# Altium project Shuttler_AMC.PrjPcb (part 3 of 20)

## Sheet SDRAM_DDR3_4x16.SchDoc: =ProjectName
size 420 x 297 mm; Author: T.P.; CompanyName: WUT; DrawnBy: T.P.; Organization: WUT ISE; Address1: Warsaw Univeristy of Technology; Address2: Nowowiejska 15/19; DocumentNumber: 23; Revision: 0.9; SheetNumber: 23; SheetTotal: 36; EDA_Number: ARTIQ; Projet: ARTIQ/SINARA; ModifiedBy: -; CreateDate: XX/XX/XXXX; CheckedDate: -; Title2: SDRAM_DDR3_4x16.SchDoc; DivGrp: ISE; Designer: G.K. and T.P.; ModifiedDate: -; ProjectName: ADC/DAC MEZZANINE
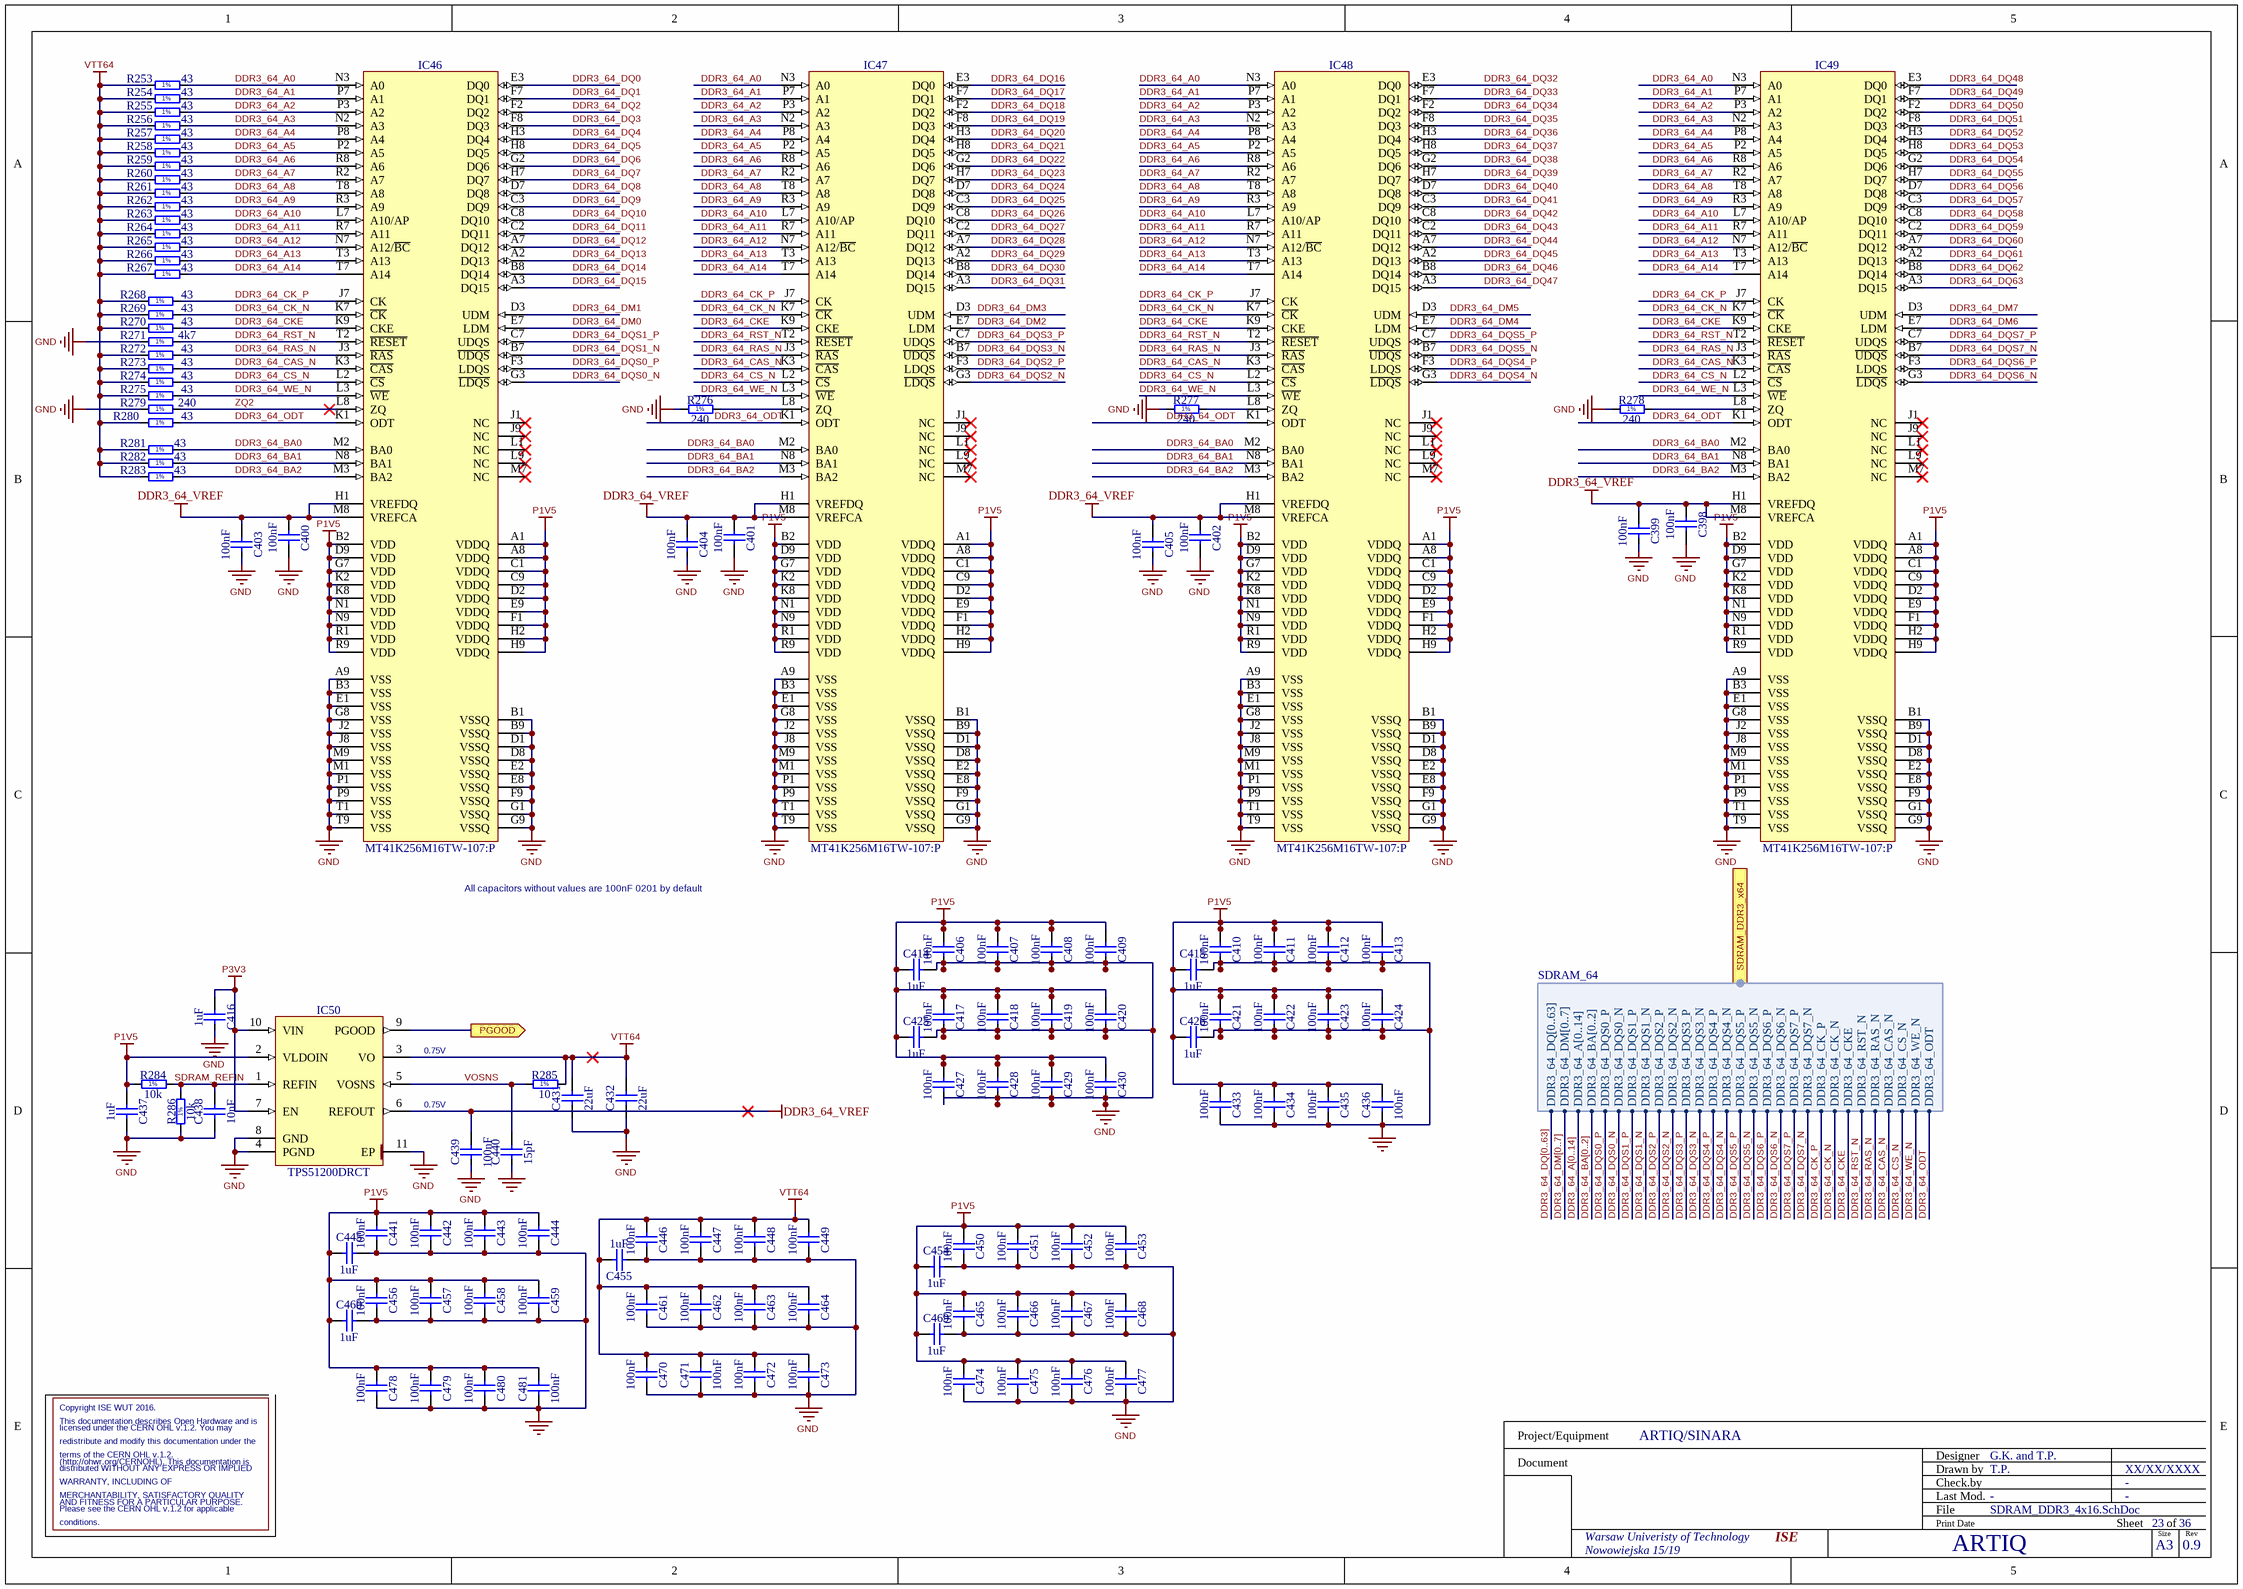
[diagram p3: SDRAM_DDR3_4x16.SchDoc]

### Parts
C398  100nF  [CAPC0603X33N]
C399  100nF  [CAPC0603X33N]
C400  100nF  [CAPC0603X33N]
C401  100nF  [CAPC0603X33N]
C402  100nF  [CAPC0603X33N]
C403  100nF  [CAPC0603X33N]
C404  100nF  [CAPC0603X33N]
C405  100nF  [CAPC0603X33N]
C406  100nF  [CAPC0603X33N]
C407  100nF  [CAPC0603X33N]
C408  100nF  [CAPC0603X33N]
C409  100nF  [CAPC0603X33N]
C410  100nF  [CAPC0603X33N]
C411  100nF  [CAPC0603X33N]
C412  100nF  [CAPC0603X33N]
C413  100nF  [CAPC0603X33N]
C414  1uF  [CAPC1005X55N]
C415  1uF  [CAPC1005X55N]
C416  1uF  [CAPC1005X55N]
C417  100nF  [CAPC0603X33N]
C418  100nF  [CAPC0603X33N]
C419  100nF  [CAPC0603X33N]
C420  100nF  [CAPC0603X33N]
C421  100nF  [CAPC0603X33N]
C422  100nF  [CAPC0603X33N]
C423  100nF  [CAPC0603X33N]
C424  100nF  [CAPC0603X33N]
C425  1uF  [CAPC1005X55N]
C426  1uF  [CAPC1005X55N]
C427  100nF  [CAPC0603X33N]
C428  100nF  [CAPC0603X33N]
C429  100nF  [CAPC0603X33N]
C430  100nF  [CAPC0603X33N]
C431  22uF  [CAPC2012X135N]
C432  22uF  [CAPC2012X135N]
C433  100nF  [CAPC0603X33N]
C434  100nF  [CAPC0603X33N]
C435  100nF  [CAPC0603X33N]
C436  100nF  [CAPC0603X33N]
C437  1uF  [CAPC1005X55N]
C438  10nF  [CAPC1005X55N]
C439  100nF  [CAPC0603X33N]
C440  15pF  [CAPC1005X55N]
C441  100nF  [CAPC0603X33N]
C442  100nF  [CAPC0603X33N]
C443  100nF  [CAPC0603X33N]
C444  100nF  [CAPC0603X33N]
C445  1uF  [CAPC1005X55N]
C446  100nF  [CAPC0603X33N]
C447  100nF  [CAPC0603X33N]
C448  100nF  [CAPC0603X33N]
C449  100nF  [CAPC0603X33N]
C450  100nF  [CAPC0603X33N]
C451  100nF  [CAPC0603X33N]
C452  100nF  [CAPC0603X33N]
C453  100nF  [CAPC0603X33N]
C454  1uF  [CAPC1005X55N]
C455  1uF  [CAPC1005X55N]
C456  100nF  [CAPC0603X33N]
C457  100nF  [CAPC0603X33N]
C458  100nF  [CAPC0603X33N]
C459  100nF  [CAPC0603X33N]
C460  1uF  [CAPC1005X55N]
C461  100nF  [CAPC0603X33N]
C462  100nF  [CAPC0603X33N]
C463  100nF  [CAPC0603X33N]
C464  100nF  [CAPC0603X33N]
C465  100nF  [CAPC0603X33N]
C466  100nF  [CAPC0603X33N]
C467  100nF  [CAPC0603X33N]
C468  100nF  [CAPC0603X33N]
C469  1uF  [CAPC1005X55N]
C470  100nF  [CAPC0603X33N]
C471  100nF  [CAPC0603X33N]
C472  100nF  [CAPC0603X33N]
C473  100nF  [CAPC0603X33N]
C474  100nF  [CAPC0603X33N]
C475  100nF  [CAPC0603X33N]
C476  100nF  [CAPC0603X33N]
C477  100nF  [CAPC0603X33N]
C478  100nF  [CAPC0603X33N]
C479  100nF  [CAPC0603X33N]
C480  100nF  [CAPC0603X33N]
C481  100nF  [CAPC0603X33N]
IC46  MT41K256M16TW-107:P  [BGA96C80P9X16_800X1400X120]
IC47  MT41K256M16TW-107:P  [BGA96C80P9X16_800X1400X120]
IC48  MT41K256M16TW-107:P  [BGA96C80P9X16_800X1400X120]
IC49  MT41K256M16TW-107:P  [BGA96C80P9X16_800X1400X120]
IC50  TPS51200DRCT  [TEXAS_DRC (S-PVSON-N10)]
R253  43  [RESC1005X40N]
R254  43  [RESC1005X40N]
R255  43  [RESC1005X40N]
R256  43  [RESC1005X40N]
R257  43  [RESC1005X40N]
R258  43  [RESC1005X40N]
R259  43  [RESC1005X40N]
R260  43  [RESC1005X40N]
R261  43  [RESC1005X40N]
R262  43  [RESC1005X40N]
R263  43  [RESC1005X40N]
R264  43  [RESC1005X40N]
R265  43  [RESC1005X40N]
R266  43  [RESC1005X40N]
R267  43  [RESC1005X40N]
R268  43  [RESC1005X40N]
R269  43  [RESC1005X40N]
R270  43  [RESC1005X40N]
R271  4k7  [RESC1005X40N]
R272  43  [RESC1005X40N]
R273  43  [RESC1005X40N]
R274  43  [RESC1005X40N]
R275  43  [RESC1005X40N]
R276  240  [RESC1005X40N]
R277  240  [RESC1005X40N]
R278  240  [RESC1005X40N]
R279  240  [RESC1005X40N]
R280  43  [RESC1005X40N]
R281  43  [RESC1005X40N]
R282  43  [RESC1005X40N]
R283  43  [RESC1005X40N]
R284  10k  [RESC1005X40N]
R285  10  [RESC1005X40N]
R286  10k  [RESC1005X40N]

### Ports
PGOOD (out), SDRAM_DDR3_x64 (harness SDRAM_64)

### Harnesses
SDRAM_64: DDR3_64_DQ[0..63], DDR3_64_DM[0..7], DDR3_64_A[0..14], DDR3_64_BA[0..2], DDR3_64_DQS1_P, DDR3_64_DQS0_N, DDR3_64_DQS0_P, DDR3_64_DQS5_P, DDR3_64_DQS5_N, DDR3_64_DQS6_P, DDR3_64_DQS6_N, DDR3_64_DQS7_P, DDR3_64_DQS7_N, DDR3_64_CK_P, DDR3_64_CK_N, DDR3_64_CKE, DDR3_64_RST_N, DDR3_64_RAS_N, DDR3_64_CAS_N, DDR3_64_WE_N, DDR3_64_CS_N, DDR3_64_DQS2_N, DDR3_64_DQS2_P, DDR3_64_DQS1_N, DDR3_64_DQS3_P, DDR3_64_ODT, DDR3_64_DQS4_P, DDR3_64_DQS3_N, DDR3_64_DQS4_N

### Nets
DDR3_64_VREF: C398.1 C399.1 C400.1 C401.1 C402.1 C403.1 C404.1 C405.1 C439.2 IC46.H1(VREFDQ) IC46.M8(VREFCA) IC47.H1(VREFDQ) IC47.M8(VREFCA) IC48.H1(VREFDQ) IC48.M8(VREFCA) IC49.H1(VREFDQ) IC49.M8(VREFCA) IC50.6(REFOUT)
GND: C398.2 C399.2 C400.2 C401.2 C402.2 C403.2 C404.2 C405.2 C406.2 C407.2 C408.2 C409.2 C410.2 C411.2 C412.2 C413.2 C414.2 C415.2 C416.2 C417.2 C418.2 C419.2 C420.2 C421.2 C422.2 C423.2 C424.2 C425.2 C426.2 C427.2 C428.2 C429.2 C430.2 C431.1 C432.1 C433.2 C434.2 C435.2 C436.1 C437.2 C438.1 C439.1 C440.1 C441.2 C442.2 C443.2 C444.2 C445.2 C446.2 C447.2 C448.2 C449.2 C450.2 C451.2 C452.2 C453.2 C454.2 C455.2 C456.2 C457.2 C458.2 C459.2 C460.2 C461.2 C462.2 C463.2 C464.2 C465.2 C466.2 C467.2 C468.2 C469.2 C470.2 C471.2 C472.2 C473.2 C474.2 C475.2 C476.2 C477.2 C478.2 C479.2 C480.2 C481.1 IC46.A9(VSS) IC46.B1(VSSQ) IC46.B3(VSS) IC46.B9(VSSQ) IC46.D1(VSSQ) IC46.D8(VSSQ) IC46.E1(VSS) IC46.E2(VSSQ) IC46.E8(VSSQ) IC46.F9(VSSQ) IC46.G1(VSSQ) IC46.G8(VSS) IC46.G9(VSSQ) IC46.J2(VSS) IC46.J8(VSS) IC46.M1(VSS) IC46.M9(VSS) IC46.P1(VSS) IC46.P9(VSS) IC46.T1(VSS) IC46.T9(VSS) IC47.A9(VSS) IC47.B1(VSSQ) IC47.B3(VSS) IC47.B9(VSSQ) IC47.D1(VSSQ) IC47.D8(VSSQ) IC47.E1(VSS) IC47.E2(VSSQ) IC47.E8(VSSQ) IC47.F9(VSSQ) IC47.G1(VSSQ) IC47.G8(VSS) IC47.G9(VSSQ) IC47.J2(VSS) IC47.J8(VSS) IC47.M1(VSS) IC47.M9(VSS) IC47.P1(VSS) IC47.P9(VSS) IC47.T1(VSS) IC47.T9(VSS) IC48.A9(VSS) IC48.B1(VSSQ) IC48.B3(VSS) IC48.B9(VSSQ) IC48.D1(VSSQ) IC48.D8(VSSQ) IC48.E1(VSS) IC48.E2(VSSQ) IC48.E8(VSSQ) IC48.F9(VSSQ) IC48.G1(VSSQ) IC48.G8(VSS) IC48.G9(VSSQ) IC48.J2(VSS) IC48.J8(VSS) IC48.M1(VSS) IC48.M9(VSS) IC48.P1(VSS) IC48.P9(VSS) IC48.T1(VSS) IC48.T9(VSS) IC49.A9(VSS) IC49.B1(VSSQ) IC49.B3(VSS) IC49.B9(VSSQ) IC49.D1(VSSQ) IC49.D8(VSSQ) IC49.E1(VSS) IC49.E2(VSSQ) IC49.E8(VSSQ) IC49.F9(VSSQ) IC49.G1(VSSQ) IC49.G8(VSS) IC49.G9(VSSQ) IC49.J2(VSS) IC49.J8(VSS) IC49.M1(VSS) IC49.M9(VSS) IC49.P1(VSS) IC49.P9(VSS) IC49.T1(VSS) IC49.T9(VSS) IC50.4(PGND) IC50.8(GND) IC50.11(EP) R271.1 R276.1 R277.1 R278.1 R279.1 R286.1
P1V5: C406.1 C407.1 C408.1 C409.1 C410.1 C411.1 C412.1 C413.1 C414.1 C415.1 C417.1 C418.1 C419.1 C420.1 C421.1 C422.1 C423.1 C424.1 C425.1 C426.1 C427.1 C428.1 C429.1 C430.1 C433.1 C434.1 C435.1 C436.2 C437.1 C441.1 C442.1 C443.1 C444.1 C445.1 C450.1 C451.1 C452.1 C453.1 C454.1 C456.1 C457.1 C458.1 C459.1 C460.1 C465.1 C466.1 C467.1 C468.1 C469.1 C474.1 C475.1 C476.1 C477.1 C478.1 C479.1 C480.1 C481.2 IC46.A1(VDDQ) IC46.A8(VDDQ) IC46.B2(VDD) IC46.C1(VDDQ) IC46.C9(VDDQ) IC46.D2(VDDQ) IC46.D9(VDD) IC46.E9(VDDQ) IC46.F1(VDDQ) IC46.G7(VDD) IC46.H2(VDDQ) IC46.H9(VDDQ) IC46.K2(VDD) IC46.K8(VDD) IC46.N1(VDD) IC46.N9(VDD) IC46.R1(VDD) IC46.R9(VDD) IC47.A1(VDDQ) IC47.A8(VDDQ) IC47.B2(VDD) IC47.C1(VDDQ) IC47.C9(VDDQ) IC47.D2(VDDQ) IC47.D9(VDD) IC47.E9(VDDQ) IC47.F1(VDDQ) IC47.G7(VDD) IC47.H2(VDDQ) IC47.H9(VDDQ) IC47.K2(VDD) IC47.K8(VDD) IC47.N1(VDD) IC47.N9(VDD) IC47.R1(VDD) IC47.R9(VDD) IC48.A1(VDDQ) IC48.A8(VDDQ) IC48.B2(VDD) IC48.C1(VDDQ) IC48.C9(VDDQ) IC48.D2(VDDQ) IC48.D9(VDD) IC48.E9(VDDQ) IC48.F1(VDDQ) IC48.G7(VDD) IC48.H2(VDDQ) IC48.H9(VDDQ) IC48.K2(VDD) IC48.K8(VDD) IC48.N1(VDD) IC48.N9(VDD) IC48.R1(VDD) IC48.R9(VDD) IC49.A1(VDDQ) IC49.A8(VDDQ) IC49.B2(VDD) IC49.C1(VDDQ) IC49.C9(VDDQ) IC49.D2(VDDQ) IC49.D9(VDD) IC49.E9(VDDQ) IC49.F1(VDDQ) IC49.G7(VDD) IC49.H2(VDDQ) IC49.H9(VDDQ) IC49.K2(VDD) IC49.K8(VDD) IC49.N1(VDD) IC49.N9(VDD) IC49.R1(VDD) IC49.R9(VDD) IC50.2(VLDOIN) R284.1
P3V3: C416.1 IC50.7(EN) IC50.10(VIN)
VTT64: C431.2 C432.2 C446.1 C447.1 C448.1 C449.1 C455.1 C461.1 C462.1 C463.1 C464.1 C470.1 C471.1 C472.1 C473.1 IC50.3(VO) R253.1 R254.1 R255.1 R256.1 R257.1 R258.1 R259.1 R260.1 R261.1 R262.1 R263.1 R264.1 R265.1 R266.1 R267.1 R268.1 R269.1 R270.1 R272.1 R273.1 R274.1 R275.1 R280.1 R281.1 R282.1 R283.1 R285.2
DDR3_64_A0: IC46.N3(A0) IC47.N3(A0) IC48.N3(A0) IC49.N3(A0) R253.2
DDR3_64_A1: IC46.P7(A1) IC47.P7(A1) IC48.P7(A1) IC49.P7(A1) R254.2
DDR3_64_A2: IC46.P3(A2) IC47.P3(A2) IC48.P3(A2) IC49.P3(A2) R255.2
DDR3_64_A3: IC46.N2(A3) IC47.N2(A3) IC48.N2(A3) IC49.N2(A3) R256.2
DDR3_64_A4: IC46.P8(A4) IC47.P8(A4) IC48.P8(A4) IC49.P8(A4) R257.2
DDR3_64_A5: IC46.P2(A5) IC47.P2(A5) IC48.P2(A5) IC49.P2(A5) R258.2
DDR3_64_A6: IC46.R8(A6) IC47.R8(A6) IC48.R8(A6) IC49.R8(A6) R259.2
DDR3_64_A7: IC46.R2(A7) IC47.R2(A7) IC48.R2(A7) IC49.R2(A7) R260.2
DDR3_64_A8: IC46.T8(A8) IC47.T8(A8) IC48.T8(A8) IC49.T8(A8) R261.2
DDR3_64_A9: IC46.R3(A9) IC47.R3(A9) IC48.R3(A9) IC49.R3(A9) R262.2
DDR3_64_A10: IC46.L7(A10/AP) IC47.L7(A10/AP) IC48.L7(A10/AP) IC49.L7(A10/AP) R263.2
DDR3_64_A11: IC46.R7(A11) IC47.R7(A11) IC48.R7(A11) IC49.R7(A11) R264.2
DDR3_64_A12: IC46.N7(A12/~{BC}) IC47.N7(A12/~{BC}) IC48.N7(A12/~{BC}) IC49.N7(A12/~{BC}) R265.2
DDR3_64_A13: IC46.T3(A13) IC47.T3(A13) IC48.T3(A13) IC49.T3(A13) R266.2
DDR3_64_A14: IC46.T7(A14) IC47.T7(A14) IC48.T7(A14) IC49.T7(A14) R267.2
DDR3_64_BA0: IC46.M2(BA0) IC47.M2(BA0) IC48.M2(BA0) IC49.M2(BA0) R281.2
DDR3_64_BA1: IC46.N8(BA1) IC47.N8(BA1) IC48.N8(BA1) IC49.N8(BA1) R282.2
DDR3_64_BA2: IC46.M3(BA2) IC47.M3(BA2) IC48.M3(BA2) IC49.M3(BA2) R283.2
DDR3_64_CAS_N: IC46.K3(~{CAS}) IC47.K3(~{CAS}) IC48.K3(~{CAS}) IC49.K3(~{CAS}) R273.2 ; port SDRAM_DDR3_x64.DDR3_64_CAS_N  [project net SDRAM_DDR3_x64.DDR3_64_CAS_N]
DDR3_64_CK_N: IC46.K7(~{CK}) IC47.K7(~{CK}) IC48.K7(~{CK}) IC49.K7(~{CK}) R269.2 ; port SDRAM_DDR3_x64.DDR3_64_CK_N  [project net SDRAM_DDR3_x64.DDR3_64_CK_N]
DDR3_64_CK_P: IC46.J7(CK) IC47.J7(CK) IC48.J7(CK) IC49.J7(CK) R268.2 ; port SDRAM_DDR3_x64.DDR3_64_CK_P  [project net SDRAM_DDR3_x64.DDR3_64_CK_P]
DDR3_64_CKE: IC46.K9(CKE) IC47.K9(CKE) IC48.K9(CKE) IC49.K9(CKE) R270.2 ; port SDRAM_DDR3_x64.DDR3_64_CKE  [project net SDRAM_DDR3_x64.DDR3_64_CKE]
DDR3_64_CS_N: IC46.L2(~{CS}) IC47.L2(~{CS}) IC48.L2(~{CS}) IC49.L2(~{CS}) R274.2 ; port SDRAM_DDR3_x64.DDR3_64_CS_N  [project net SDRAM_DDR3_x64.DDR3_64_CS_N]
DDR3_64_DM0: IC46.E7(LDM)
DDR3_64_DM1: IC46.D3(UDM)
DDR3_64_DM2: IC47.E7(LDM)
DDR3_64_DM3: IC47.D3(UDM)
DDR3_64_DM4: IC48.E7(LDM)
DDR3_64_DM5: IC48.D3(UDM)
DDR3_64_DM6: IC49.E7(LDM)
DDR3_64_DM7: IC49.D3(UDM)
DDR3_64_DQ0: IC46.E3(DQ0)
DDR3_64_DQ1: IC46.F7(DQ1)
DDR3_64_DQ2: IC46.F2(DQ2)
DDR3_64_DQ3: IC46.F8(DQ3)
DDR3_64_DQ4: IC46.H3(DQ4)
DDR3_64_DQ5: IC46.H8(DQ5)
DDR3_64_DQ6: IC46.G2(DQ6)
DDR3_64_DQ7: IC46.H7(DQ7)
DDR3_64_DQ8: IC46.D7(DQ8)
DDR3_64_DQ9: IC46.C3(DQ9)
DDR3_64_DQ10: IC46.C8(DQ10)
DDR3_64_DQ11: IC46.C2(DQ11)
DDR3_64_DQ12: IC46.A7(DQ12)
DDR3_64_DQ13: IC46.A2(DQ13)
DDR3_64_DQ14: IC46.B8(DQ14)
DDR3_64_DQ15: IC46.A3(DQ15)
DDR3_64_DQ16: IC47.E3(DQ0)
DDR3_64_DQ17: IC47.F7(DQ1)
DDR3_64_DQ18: IC47.F2(DQ2)
DDR3_64_DQ19: IC47.F8(DQ3)
DDR3_64_DQ20: IC47.H3(DQ4)
DDR3_64_DQ21: IC47.H8(DQ5)
DDR3_64_DQ22: IC47.G2(DQ6)
DDR3_64_DQ23: IC47.H7(DQ7)
DDR3_64_DQ24: IC47.D7(DQ8)
DDR3_64_DQ25: IC47.C3(DQ9)
DDR3_64_DQ26: IC47.C8(DQ10)
DDR3_64_DQ27: IC47.C2(DQ11)
DDR3_64_DQ28: IC47.A7(DQ12)
DDR3_64_DQ29: IC47.A2(DQ13)
DDR3_64_DQ30: IC47.B8(DQ14)
DDR3_64_DQ31: IC47.A3(DQ15)
DDR3_64_DQ32: IC48.E3(DQ0)
DDR3_64_DQ33: IC48.F7(DQ1)
DDR3_64_DQ34: IC48.F2(DQ2)
DDR3_64_DQ35: IC48.F8(DQ3)
DDR3_64_DQ36: IC48.H3(DQ4)
DDR3_64_DQ37: IC48.H8(DQ5)
DDR3_64_DQ38: IC48.G2(DQ6)
DDR3_64_DQ39: IC48.H7(DQ7)
DDR3_64_DQ40: IC48.D7(DQ8)
DDR3_64_DQ41: IC48.C3(DQ9)
DDR3_64_DQ42: IC48.C8(DQ10)
DDR3_64_DQ43: IC48.C2(DQ11)
DDR3_64_DQ44: IC48.A7(DQ12)
DDR3_64_DQ45: IC48.A2(DQ13)
DDR3_64_DQ46: IC48.B8(DQ14)
DDR3_64_DQ47: IC48.A3(DQ15)
DDR3_64_DQ48: IC49.E3(DQ0)
DDR3_64_DQ49: IC49.F7(DQ1)
DDR3_64_DQ50: IC49.F2(DQ2)
DDR3_64_DQ51: IC49.F8(DQ3)
DDR3_64_DQ52: IC49.H3(DQ4)
DDR3_64_DQ53: IC49.H8(DQ5)
DDR3_64_DQ54: IC49.G2(DQ6)
DDR3_64_DQ55: IC49.H7(DQ7)
DDR3_64_DQ56: IC49.D7(DQ8)
DDR3_64_DQ57: IC49.C3(DQ9)
DDR3_64_DQ58: IC49.C8(DQ10)
DDR3_64_DQ59: IC49.C2(DQ11)
DDR3_64_DQ60: IC49.A7(DQ12)
DDR3_64_DQ61: IC49.A2(DQ13)
DDR3_64_DQ62: IC49.B8(DQ14)
DDR3_64_DQ63: IC49.A3(DQ15)
DDR3_64_DQS0_N: IC46.G3(~{LDQS}) ; port SDRAM_DDR3_x64.DDR3_64_DQS0_N  [project net SDRAM_DDR3_x64.DDR3_64_DQS0_N]
DDR3_64_DQS0_P: IC46.F3(LDQS) ; port SDRAM_DDR3_x64.DDR3_64_DQS0_P  [project net SDRAM_DDR3_x64.DDR3_64_DQS0_P]
DDR3_64_DQS1_N: IC46.B7(~{UDQS}) ; port SDRAM_DDR3_x64.DDR3_64_DQS1_N  [project net SDRAM_DDR3_x64.DDR3_64_DQS1_N]
DDR3_64_DQS1_P: IC46.C7(UDQS) ; port SDRAM_DDR3_x64.DDR3_64_DQS1_P  [project net SDRAM_DDR3_x64.DDR3_64_DQS1_P]
DDR3_64_DQS2_N: IC47.G3(~{LDQS}) ; port SDRAM_DDR3_x64.DDR3_64_DQS2_N  [project net SDRAM_DDR3_x64.DDR3_64_DQS2_N]
DDR3_64_DQS2_P: IC47.F3(LDQS) ; port SDRAM_DDR3_x64.DDR3_64_DQS2_P  [project net SDRAM_DDR3_x64.DDR3_64_DQS2_P]
DDR3_64_DQS3_N: IC47.B7(~{UDQS}) ; port SDRAM_DDR3_x64.DDR3_64_DQS3_N  [project net SDRAM_DDR3_x64.DDR3_64_DQS3_N]
DDR3_64_DQS3_P: IC47.C7(UDQS) ; port SDRAM_DDR3_x64.DDR3_64_DQS3_P  [project net SDRAM_DDR3_x64.DDR3_64_DQS3_P]
DDR3_64_DQS4_N: IC48.G3(~{LDQS}) ; port SDRAM_DDR3_x64.DDR3_64_DQS4_N  [project net SDRAM_DDR3_x64.DDR3_64_DQS4_N]
DDR3_64_DQS4_P: IC48.F3(LDQS) ; port SDRAM_DDR3_x64.DDR3_64_DQS4_P  [project net SDRAM_DDR3_x64.DDR3_64_DQS4_P]
DDR3_64_DQS5_N: IC48.B7(~{UDQS}) ; port SDRAM_DDR3_x64.DDR3_64_DQS5_N  [project net SDRAM_DDR3_x64.DDR3_64_DQS5_N]
DDR3_64_DQS5_P: IC48.C7(UDQS) ; port SDRAM_DDR3_x64.DDR3_64_DQS5_P  [project net SDRAM_DDR3_x64.DDR3_64_DQS5_P]
DDR3_64_DQS6_N: IC49.G3(~{LDQS}) ; port SDRAM_DDR3_x64.DDR3_64_DQS6_N  [project net SDRAM_DDR3_x64.DDR3_64_DQS6_N]
DDR3_64_DQS6_P: IC49.F3(LDQS) ; port SDRAM_DDR3_x64.DDR3_64_DQS6_P  [project net SDRAM_DDR3_x64.DDR3_64_DQS6_P]
DDR3_64_DQS7_N: IC49.B7(~{UDQS}) ; port SDRAM_DDR3_x64.DDR3_64_DQS7_N  [project net SDRAM_DDR3_x64.DDR3_64_DQS7_N]
DDR3_64_DQS7_P: IC49.C7(UDQS) ; port SDRAM_DDR3_x64.DDR3_64_DQS7_P  [project net SDRAM_DDR3_x64.DDR3_64_DQS7_P]
DDR3_64_ODT: IC46.K1(ODT) IC47.K1(ODT) IC48.K1(ODT) IC49.K1(ODT) R280.2 ; port SDRAM_DDR3_x64.DDR3_64_ODT  [project net SDRAM_DDR3_x64.DDR3_64_ODT]
DDR3_64_RAS_N: IC46.J3(~{RAS}) IC47.J3(~{RAS}) IC48.J3(~{RAS}) IC49.J3(~{RAS}) R272.2 ; port SDRAM_DDR3_x64.DDR3_64_RAS_N  [project net SDRAM_DDR3_x64.DDR3_64_RAS_N]
DDR3_64_RST_N: IC46.T2(~{RESET}) IC47.T2(~{RESET}) IC48.T2(~{RESET}) IC49.T2(~{RESET}) R271.2 ; port SDRAM_DDR3_x64.DDR3_64_RST_N  [project net SDRAM_DDR3_x64.DDR3_64_RST_N]
DDR3_64_WE_N: IC46.L3(~{WE}) IC47.L3(~{WE}) IC48.L3(~{WE}) IC49.L3(~{WE}) R275.2 ; port SDRAM_DDR3_x64.DDR3_64_WE_N  [project net SDRAM_DDR3_x64.DDR3_64_WE_N]
SDRAM_PGOOD: IC50.9(PGOOD) ; port PGOOD
SDRAM_REFIN: C438.2 IC50.1(REFIN) R284.2 R286.2
VOSNS: C440.2 IC50.5(VOSNS) R285.1
ZQ2: IC46.L8(ZQ) R279.2
NetIC47_L8: IC47.L8(ZQ) R276.2
NetIC48_L8: IC48.L8(ZQ) R277.2
NetIC49_L8: IC49.L8(ZQ) R278.2

Not connected (* = marked no-connect by the designer): IC46 J1(NC)* J9(NC)* L1(NC)* L9(NC)* M7(NC)*; IC47 J1(NC)* J9(NC)* L1(NC)* L9(NC)* M7(NC)*; IC48 J1(NC)* J9(NC)* L1(NC)* L9(NC)* M7(NC)*; IC49 J1(NC)* J9(NC)* L1(NC)* L9(NC)* M7(NC)*

### Buses and harness runs
bus DDR3_64_A[0..14]
bus DDR3_64_BA[0..2]
bus DDR3_64_DM[0..7]
bus DDR3_64_DQ[0..63]

### Notes on the sheet
- All capacitors without values are 100nF 0201 by default
- (near IC50) 0.75V
- 0.75V
- Copyright ISE WUT 2016.
- terms of the CERN OHL v.1.2.
- This documentation describes Open Hardware and is
- (http://ohwr.org/CERNOHL). This documentation is
- redistribute and modify this documentation under the
- distributed WITHOUT ANY EXPRESS OR IMPLIED
- WARRANTY, INCLUDING OF
- licensed under the CERN OHL v.1.2. You may
- Please see the CERN OHL v.1.2 for applicable
- conditions.
- MERCHANTABILITY, SATISFACTORY QUALITY
- AND FITNESS FOR A PARTICULAR PURPOSE.
- Project/Equipment
- Document
- Designer
- Drawn by
- Check.by
- File
- Last Mod.
- Print Date
- Sheet
- Size
- A3
- of
- Rev
- (in symbol R0402_4K7_1%_0.0625W_100PPM) 1%
- (in symbol R0402_10K_1%_0.0625W_100PPM) 1%
- (in symbol R0402_10R_1%_0.0625W_200PPM) 1%
- (in symbol R0402_43R_1%_0.0625W_100PPM) 1%
- (in symbol R0402_240R_1%_0.0625W_100PPM) 1%

### Library data of the parts
C398-C413 C417-C424 C427-C430 C433-C436 C439 C441-C444 C446-C453 C456-C459 C461-C468 C470-C481 = CC0201_100NF_6.3V_10%_X5R: Non-polarised capacitor; Manufacturer: GENERIC; Manufacturer1 Part Number: 02016D104KAT2A; Part Description: SMD Multilayer Chip Ceramic Capacitor; TC: X5R; Tolerance: ±10%; Voltage: 6.3V; Author: CERN DEM JLC; Case: 0201; Component Kind: Standard; Component Type: Standard; CreateDate: 03.12.2007; HelpURL: \\cern.ch\dfs\Applications\Altium\Datasheets\CC0201_X5R_AVX.pdf; LatestRevisionDate: 03.12.2007; Manufacturer Part Number: CC0201_100NF_6.3V_10%_X5R; Manufacturer1 ComponentHeight: 0.33mm; Manufacturer1 Example: AVX; Mounted: Yes; Part Number: CC0201_100NF_6.3V_10%_X5R; Pin Count: 2; SMD: Yes; Socket: No; Status: Not Recommended; Value: 100nF; Sense: No
C414-C416 C425 C426 C437 C445 C454 C455 C460 C469 = CC0402_1UF_16V_10%_X5R: Non-polarised capacitor; Manufacturer: GENERIC; Part Description: SMD Multilayer Chip Ceramic Capacitor; Manufacturer1 Part Number: C1005X5R1C105KT; Tolerance: ±10%; Voltage: 16V; TC: X5R; Manufacturer Part Number: CC0402_1UF_16V_10%_X5R; Part Number: CC0402_1UF_16V_10%_X5R; Value: 1uF; Component Kind: Standard; Component Type: Standard; Pin Count: 2; Status: Preferred; Case: 0402; Mounted: Yes; Socket: No; SMD: Yes; Sense: No; Manufacturer1 Example: TDK; Manufacturer1 ComponentHeight: 0.55mm; HelpURL: \\cern.ch\dfs\Applications\Altium\Datasheets\CC0402_X5R_TDK_C.pdf; Author: CERN DEM JLC; CreateDate: 25.10.2012; LatestRevisionDate: 25.10.2012
C431 C432 = CC0805_22UF_10V_+80%-20%_Y5V: Non-polarised capacitor; Manufacturer: GENERIC; Part Description: SMD Multilayer Chip Ceramic Capacitor; Manufacturer1 Part Number: 2222 241 19881; Voltage: 10V; TC: Y5V; Manufacturer Part Number: CC0805_22UF_10V_+80%-20%_Y5V; Part Number: CC0805_22UF_10V_+80%-20%_Y5V; Tolerance: +80% -20%; Value: 22uF; Component Kind: Standard; Component Type: Standard; Pin Count: 2; Status: Preferred; Case: 0805; Mounted: Yes; Socket: No; SMD: Yes; Sense: No; Manufacturer1 Example: PHYCOMP; Manufacturer1 ComponentHeight: 1.45mm; HelpURL: \\cern.ch\dfs\Applications\Altium\Datasheets\CC0805_Y5V_PHYCOMP.pdf; Author: CERN DEM JLC; CreateDate: 03.12.2007; LatestRevisionDate: 03.12.2007
C438 = CC0402_10NF_25V_10%_X7R: Non-polarised capacitor; Manufacturer: GENERIC; Part Description: SMD Multilayer Chip Ceramic Capacitor; Manufacturer1 Part Number: C1005X7R1E103KT; Tolerance: ±10%; Voltage: 25V; TC: X7R; Manufacturer Part Number: CC0402_10NF_25V_10%_X7R; Part Number: CC0402_10NF_25V_10%_X7R; Value: 10nF; Component Kind: Standard; Component Type: Standard; Pin Count: 2; Status: Preferred; Case: 0402; Mounted: Yes; Socket: No; SMD: Yes; Sense: No; Manufacturer1 Example: TDK; Manufacturer1 ComponentHeight: 0.55mm; HelpURL: \\cern.ch\dfs\Applications\Altium\Datasheets\CC0402_X7R_TDK_C.pdf; Author: CERN DEM JLC; CreateDate: 25.10.2012; LatestRevisionDate: 25.10.2012
C440 = CC0402_15PF_50V_5%_C0G: Non-polarised capacitor; Manufacturer: GENERIC; Part Description: SMD Multilayer Chip Ceramic Capacitor; Manufacturer1 Part Number: C0402C150J5GACTU; Tolerance: ±5%; Voltage: 50V; TC: C0G/NP0; Manufacturer Part Number: CC0402_15PF_50V_5%_C0G; Part Number: CC0402_15PF_50V_5%_C0G; Value: 15pF; Component Kind: Standard; Component Type: Standard; Pin Count: 2; Status: Preferred; Case: 0402; Mounted: Yes; Socket: No; SMD: Yes; Sense: No; Manufacturer1 Example: KEMET; Manufacturer1 ComponentHeight: 0.55mm; HelpURL: \\cern.ch\dfs\Applications\Altium\Datasheets\CC0805_C0G_KEMET_(Commercial Grade).pdf; Author: CERN DEM JLC; CreateDate: 03.12.2007; LatestRevisionDate: 22.04.2015
IC46-IC49 = MT41K256M16TW-107:P: 32 Meg x 16 x 8 Banks DDR3L SDRAM; Part Description: +1.5V, 4Gb (32Meg x 16 x 8 banks) DDR3L SDRAM; Manufacturer: MICRON TECHNOLOGY; PressFit: No; Bonding: No; Part Number: MT41K256M16TW-107:P; Component Kind: Standard; Component Type: Standard; Device: MT41K256M16TW-107:P; PackageDescription: BGA 0.8mm, Pitch, Square 96 Pin, 9 Columns x 16 Rows, Body 14mm X 8mm X 1.2mm H; Manufacturer Part Number: MT41K256M16TW-107:P; Pin Count: 96; Case: BGA96; Mounted: Yes; Socket: No; SMD: Yes; Sense: No; ComponentHeight: 1.2mm; HelpURL: \\cern.ch\dfs\Applications\Altium\Datasheets\MT41K256M16TW-107-P.pdf; Author: CERN DEM MR; CreateDate: 14.12.2015; LatestRevisionDate: 14.12.2015
IC50 = TPS51200DRCT: Sink/Source DDR Termination Regulator; Manufacturer: TEXAS INSTRUMENTS; Part Description: 3.3V Sink/Source DDR Termination Regulator; PressFit: No; Bonding: No; Manufacturer Part Number: TPS51200DRCT; PackageDescription: SON, 0.50mm Pitch, 10-pin, 3.00mm W  X 3.00mm L X 1.00mm Height, (w/thermal tab 1.75 X 2.50 mm); Part Number: TPS51200DRCT; Component Kind: Standard; Component Type: Standard; Device: TPS51200DRCT; Pin Count: 11; Case: SON10; Mounted: Yes; Socket: No; SMD: Yes; Sense: No; ComponentHeight: 1mm; HelpURL: \\cern.ch\dfs\Applications\Altium\Datasheets\TPS51200DRCT.pdf; Author: CERN DEM JLC; CreateDate: 03.02.2010; LatestRevisionDate: 06.11.2013
R253-R270 R272-R275 R280-R283 = R0402_43R_1%_0.0625W_100PPM: Resistor - 1%; Manufacturer: GENERIC; Part Description: General Purpose Thick Film Chip Resistor; Manufacturer1 Part Number: 232270674309L; TC: ±100ppm/°C; PressFit: No; Manufacturer Part Number: R0402_43R_1%_0.0625W_100PPM; Part Number: R0402_43R_1%_0.0625W_100PPM; Tolerance: ±1%; Value: 43; Component Kind: Standard; Component Type: Standard; Pin Count: 2; Status: Not Recommended; Power: 0.0625W; Case: 0402; Mounted: Yes; Sense: No; Socket: No; SMD: Yes; Manufacturer1 Example: YAGEO PHYCOMP; Manufacturer1 ComponentHeight: 0.4mm; HelpURL: \\cern.ch\dfs\Applications\Altium\Datasheets\R0402_Phycomp_RC0402.pdf; Author: CERN DEM JLC; CreateDate: 03.12.2007; LatestRevisionDate: 17.10.2012
R271 = R0402_4K7_1%_0.0625W_100PPM: Resistor - 1%; Manufacturer: GENERIC; Part Description: General Purpose Thick Film Chip Resistor; Manufacturer1 Part Number: 232270674702L; TC: ±100ppm/°C; PressFit: No; Manufacturer Part Number: R0402_4K7_1%_0.0625W_100PPM; Part Number: R0402_4K7_1%_0.0625W_100PPM; Tolerance: ±1%; Value: 4k7; Component Kind: Standard; Component Type: Standard; Pin Count: 2; Status: Not Recommended; Power: 0.0625W; Case: 0402; Mounted: Yes; Sense: No; Socket: No; SMD: Yes; Manufacturer1 Example: YAGEO PHYCOMP; Manufacturer1 ComponentHeight: 0.4mm; HelpURL: \\cern.ch\dfs\Applications\Altium\Datasheets\R0402_Phycomp_RC0402.pdf; Author: CERN DEM JLC; CreateDate: 03.12.2007; LatestRevisionDate: 17.10.2012
R276-R279 = R0402_240R_1%_0.0625W_100PPM: Resistor - 1%; Manufacturer: GENERIC; Part Description: General Purpose Thick Film Chip Resistor; Manufacturer1 Part Number: 232270672401L; TC: ±100ppm/°C; PressFit: No; Manufacturer Part Number: R0402_240R_1%_0.0625W_100PPM; Part Number: R0402_240R_1%_0.0625W_100PPM; Tolerance: ±1%; Value: 240; Component Kind: Standard; Component Type: Standard; Pin Count: 2; Status: Not Recommended; Power: 0.0625W; Case: 0402; Mounted: Yes; Sense: No; Socket: No; SMD: Yes; Manufacturer1 Example: YAGEO PHYCOMP; Manufacturer1 ComponentHeight: 0.4mm; HelpURL: \\cern.ch\dfs\Applications\Altium\Datasheets\R0402_Phycomp_RC0402.pdf; Author: CERN DEM JLC; CreateDate: 03.12.2007; LatestRevisionDate: 17.10.2012
R284 R286 = R0402_10K_1%_0.0625W_100PPM: Resistor - 1%; Manufacturer: GENERIC; Part Description: General Purpose Thick Film Chip Resistor; Manufacturer1 Part Number: 232270671003L; TC: ±100ppm/°C; PressFit: No; Manufacturer Part Number: R0402_10K_1%_0.0625W_100PPM; Part Number: R0402_10K_1%_0.0625W_100PPM; Tolerance: ±1%; Value: 10k; Component Kind: Standard; Component Type: Standard; Pin Count: 2; Status: Not Recommended; Power: 0.0625W; Case: 0402; Mounted: Yes; Sense: No; Socket: No; SMD: Yes; Manufacturer1 Example: YAGEO PHYCOMP; Manufacturer1 ComponentHeight: 0.4mm; HelpURL: \\cern.ch\dfs\Applications\Altium\Datasheets\R0402_Phycomp_RC0402.pdf; Author: CERN DEM JLC; CreateDate: 03.12.2007; LatestRevisionDate: 17.10.2012
R285 = R0402_10R_1%_0.0625W_200PPM: Resistor - 1%; Manufacturer: GENERIC; Part Description: General Purpose Thick Film Chip Resistor; Manufacturer1 Part Number: 232270671009L; TC: ±200ppm/°C; PressFit: No; Manufacturer Part Number: R0402_10R_1%_0.0625W_200PPM; Part Number: R0402_10R_1%_0.0625W_200PPM; Tolerance: ±1%; Value: 10; Component Kind: Standard; Component Type: Standard; Pin Count: 2; Status: Not Recommended; Power: 0.0625W; Case: 0402; Mounted: Yes; Sense: No; Socket: No; SMD: Yes; Manufacturer1 Example: YAGEO PHYCOMP; Manufacturer1 ComponentHeight: 0.4mm; HelpURL: \\cern.ch\dfs\Applications\Altium\Datasheets\R0402_Phycomp_RC0402.pdf; Author: CERN DEM JLC; CreateDate: 24.06.2009; LatestRevisionDate: 17.10.2012

## Sheet JTAG_Configuration.SchDoc: =ProjectName
size 420 x 297 mm; Author: T.P.; CompanyName: WUT; DrawnBy: T.P.; Organization: WUT ISE; Address1: Warsaw Univeristy of Technology; Address2: Nowowiejska 15/19; DocumentNumber: 33; Revision: 0.9; SheetNumber: 33; SheetTotal: 36; EDA_Number: ARTIQ; Projet: ARTIQ/SINARA; ModifiedBy: -; CreateDate: XX/XX/XXXX; CheckedDate: -; Title2: JTAG_Configuration.SchDoc; DivGrp: ISE; Designer: G.K. and T.P.; ModifiedDate: -; ProjectName: ADC/DAC MEZZANINE
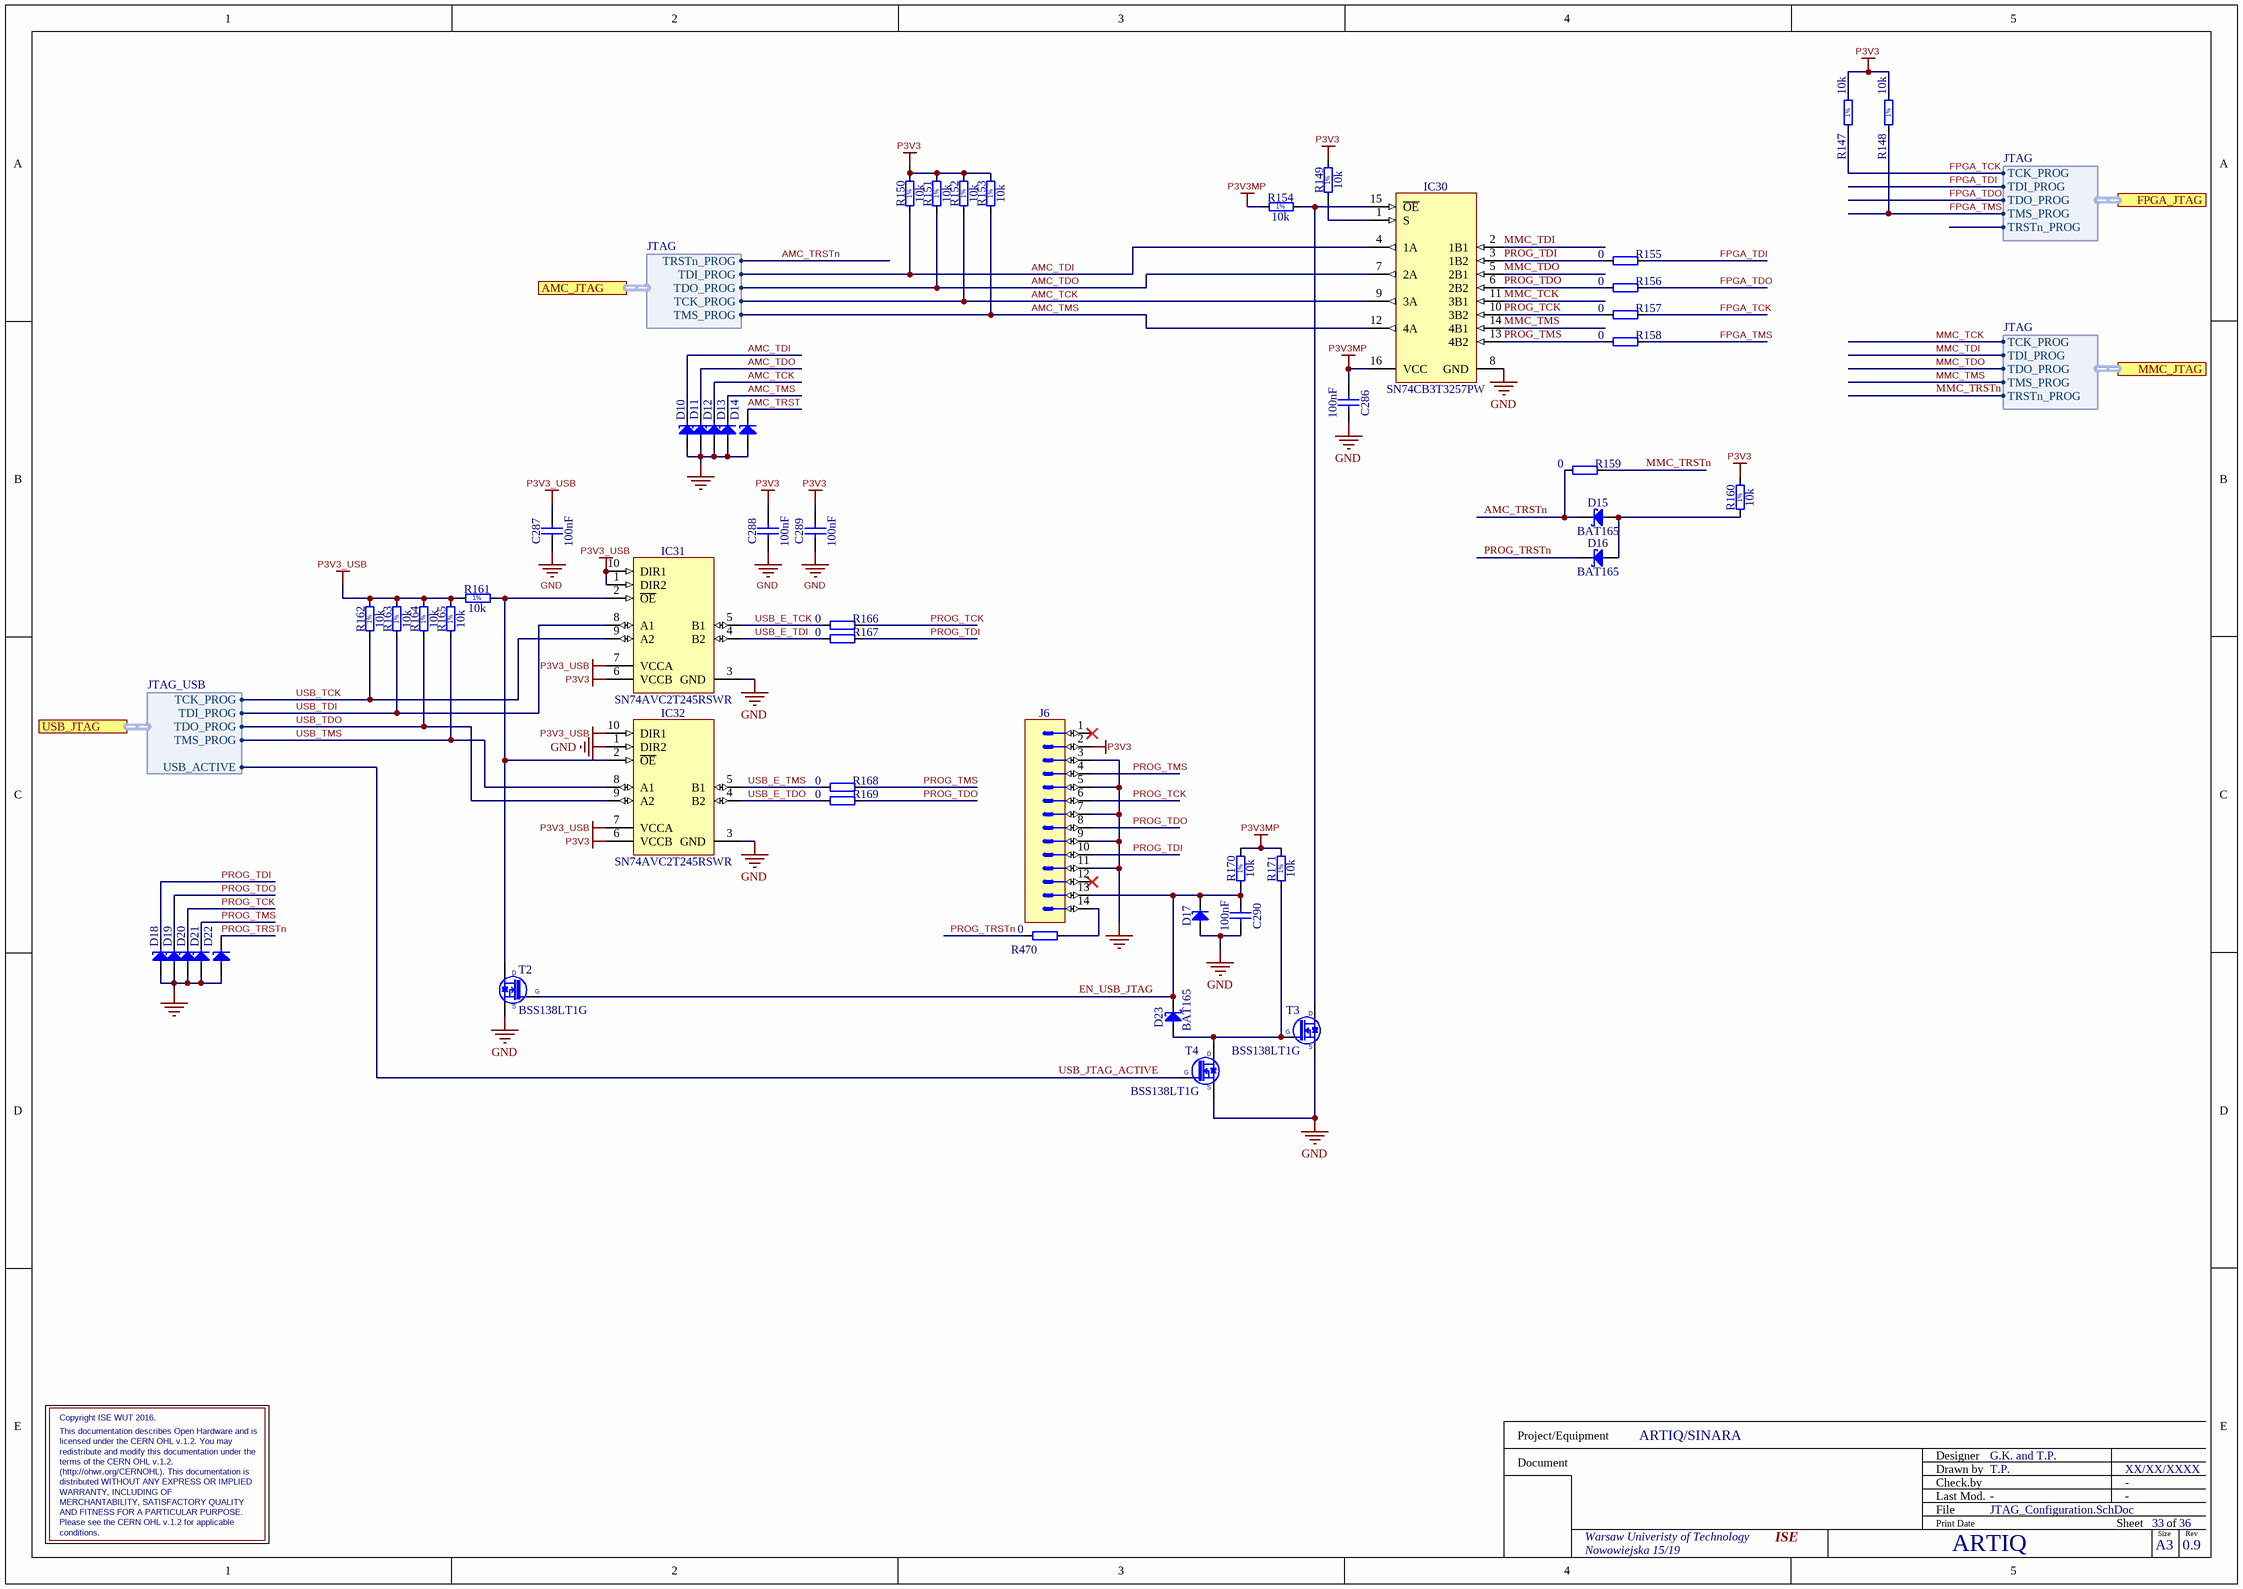
[diagram p4: JTAG_Configuration.SchDoc]

### Parts
C286  100nF  [CAPC0603X33N]
C287  100nF  [CAPC0603X33N]
C288  100nF  [CAPC0603X33N]
C289  100nF  [CAPC0603X33N]
C290  100nF  [CAPC0603X33N]
D10  PESD3V3S1UB  [SODFL1608X65N]  (value not drawn)
D11  PESD3V3S1UB  [SODFL1608X65N]  (value not drawn)
D12  PESD3V3S1UB  [SODFL1608X65N]  (value not drawn)
D13  PESD3V3S1UB  [SODFL1608X65N]  (value not drawn)
D14  PESD3V3S1UB  [SODFL1608X65N]  (value not drawn)
D15  BAT165  [SOD2512X110N]
D16  BAT165  [SOD2512X110N]
D17  PESD3V3S1UB  [SODFL1608X65N]  (value not drawn)
D18  PESD3V3S1UB  [SODFL1608X65N]  (value not drawn)
D19  PESD3V3S1UB  [SODFL1608X65N]  (value not drawn)
D20  PESD3V3S1UB  [SODFL1608X65N]  (value not drawn)
D21  PESD3V3S1UB  [SODFL1608X65N]  (value not drawn)
D22  PESD3V3S1UB  [SODFL1608X65N]  (value not drawn)
D23  BAT165  [SOD2512X110N]
IC30  SN74CB3T3257PW  [SOP65P640X120-16N]
IC31  SN74AVC2T245RSWR  [QFN40P140X180X55-10N]
IC32  SN74AVC2T245RSWR  [QFN40P140X180X55-10N]
J6  Milli-Grid™  [MOLEX_87832-1420]  (value not drawn)
R147  10k  [RESC1005X40N]
R148  10k  [RESC1005X40N]
R149  10k  [RESC1005X40N]
R150  10k  [RESC1005X40N]
R151  10k  [RESC1005X40N]
R152  10k  [RESC1005X40N]
R153  10k  [RESC1005X40N]
R154  10k  [RESC1005X40N]
R155  0  [RESC1005X40N]
R156  0  [RESC1005X40N]
R157  0  [RESC1005X40N]
R158  0  [RESC1005X40N]
R159  0  [RESC1005X40N]
R160  10k  [RESC1005X40N]
R161  10k  [RESC1005X40N]
R162  10k  [RESC1005X40N]
R163  10k  [RESC1005X40N]
R164  10k  [RESC1005X40N]
R165  10k  [RESC1005X40N]
R166  0  [RESC1005X40N]
R167  0  [RESC1005X40N]
R168  0  [RESC1005X40N]
R169  0  [RESC1005X40N]
R170  10k  [RESC1005X40N]
R171  10k  [RESC1005X40N]
R470  0  [RESC1005X40N]
T2  BSS138LT1G  [SOT95P240X110-3N]
T3  BSS138LT1G  [SOT95P240X110-3N]
T4  BSS138LT1G  [SOT95P240X110-3N]

### Ports
AMC_JTAG (harness JTAG), FPGA_JTAG (harness JTAG), MMC_JTAG (harness JTAG), USB_JTAG (harness JTAG_USB)

### Harnesses
JTAG: TDO_PROG, TDI_PROG, TCK_PROG, TMS_PROG, TRSTn_PROG
JTAG_USB: TDO_PROG, TDI_PROG, TCK_PROG, TMS_PROG, USB_ACTIVE

### Nets
GND: C286.1 C287.1 C288.1 C289.1 C290.1 D10.2(A) D11.2(A) D12.2(A) D13.2(A) D14.2(A) D17.2(A) D18.2(A) D19.2(A) D20.2(A) D21.2(A) D22.2(A) IC30.8(GND) IC31.3(GND) IC32.1(DIR2) IC32.3(GND) J6.3 J6.5 J6.7 J6.9 J6.11 T2.2(S) T3.2(S) T4.2(S)
P3V3: C288.2 C289.2 IC31.6(VCCB) IC32.6(VCCB) J6.2 R147.1 R148.1 R149.2 R150.2 R151.2 R152.2 R153.2 R160.2
P3V3_USB: C287.2 IC31.1(DIR2) IC31.7(VCCA) IC31.10(DIR1) IC32.7(VCCA) IC32.10(DIR1) R161.1 R162.2 R163.2 R164.2 R165.2
P3V3MP: C286.2 IC30.16(VCC) R154.1 R170.2 R171.2
AMC_TCK: D12.1(C) IC30.9(3A) R152.1 ; port AMC_JTAG.TCK_PROG  [project net AMC_JTAG.TCK_PROG]
AMC_TDI: D10.1(C) IC30.4(1A) R150.1 ; port AMC_JTAG.TDI_PROG  [project net AMC_JTAG.TDI_PROG]
AMC_TDO: D11.1(C) IC30.7(2A) R151.1 ; port AMC_JTAG.TDO_PROG  [project net AMC_JTAG.TDO_PROG]
AMC_TMS: D13.1(C) IC30.12(4A) R153.1 ; port AMC_JTAG.TMS_PROG  [project net AMC_JTAG.TMS_PROG]
AMC_TRST: D14.1(C)
AMC_TRSTn: D15.1(C) R159.2 ; port AMC_JTAG.TRSTn_PROG  [project net AMC_JTAG.TRSTn_PROG]
EN_USB_JTAG: C290.2 D17.1(C) D23.1(C) J6.13 R170.1 T2.1(G)
FPGA_TCK: R147.2 R157.1 ; port FPGA_JTAG.TCK_PROG  [project net FPGA_JTAG.TCK_PROG]
FPGA_TDI: R155.1 ; port FPGA_JTAG.TDI_PROG  [project net FPGA_JTAG.TDI_PROG]
FPGA_TDO: R156.1 ; port FPGA_JTAG.TDO_PROG  [project net FPGA_JTAG.TDO_PROG]
FPGA_TMS: R148.2 R158.1 ; port FPGA_JTAG.TMS_PROG  [project net FPGA_JTAG.TMS_PROG]
MMC_TCK: IC30.11(3B1) ; port MMC_JTAG.TCK_PROG
MMC_TDI: IC30.2(1B1) ; port MMC_JTAG.TDI_PROG
MMC_TDO: IC30.5(2B1) ; port MMC_JTAG.TDO_PROG
MMC_TMS: IC30.14(4B1) ; port MMC_JTAG.TMS_PROG
MMC_TRSTn: R159.1 ; port MMC_JTAG.TRSTn_PROG
PROG_TCK: D20.1(C) IC30.10(3B2) J6.6 R157.2 R166.1
PROG_TDI: D18.1(C) IC30.3(1B2) J6.10 R155.2 R167.1
PROG_TDO: D19.1(C) IC30.6(2B2) J6.8 R156.2 R169.1
PROG_TMS: D21.1(C) IC30.13(4B2) J6.4 R158.2 R168.1
PROG_TRSTn: D16.1(C) D22.1(C) R470.2
USB_E_TCK: IC31.5(B1) R166.2
USB_E_TDI: IC31.4(B2) R167.2
USB_E_TDO: IC32.4(B2) R169.2
USB_E_TMS: IC32.5(B1) R168.2
USB_JTAG_ACTIVE: T4.1(G) ; port USB_JTAG.USB_ACTIVE  [project net USB_JTAG.USB_ACTIVE]
USB_TCK: IC31.9(A2) R162.1 ; port USB_JTAG.TCK_PROG  [project net USB_JTAG.TCK_PROG]
USB_TDI: IC31.8(A1) R163.1 ; port USB_JTAG.TDI_PROG  [project net USB_JTAG.TDI_PROG]
USB_TDO: IC32.9(A2) R164.1 ; port USB_JTAG.TDO_PROG  [project net USB_JTAG.TDO_PROG]
USB_TMS: IC32.8(A1) R165.1 ; port USB_JTAG.TMS_PROG  [project net USB_JTAG.TMS_PROG]
NetD15_2: D15.2(A) D16.2(A) R160.1
NetD23_2: D23.2(A) R171.1 T3.1(G) T4.3(D)
NetIC30_1: IC30.1(S) R149.1
NetIC30_15: IC30.15(~{OE}) R154.2 T3.3(D)
NetIC31_2: IC31.2(~{OE}) IC32.2(~{OE}) R161.2 T2.3(D)
NetJ6_14: J6.14 R470.1

Not connected (* = marked no-connect by the designer): J6 1* 12*

### Notes on the sheet
- Copyright ISE WUT 2016.
- (http://ohwr.org/CERNOHL). This documentation is
- This documentation describes Open Hardware and is
- distributed WITHOUT ANY EXPRESS OR IMPLIED
- licensed under the CERN OHL v.1.2. You may
- terms of the CERN OHL v.1.2.
- redistribute and modify this documentation under the
- conditions.
- MERCHANTABILITY, SATISFACTORY QUALITY
- Please see the CERN OHL v.1.2 for applicable
- AND FITNESS FOR A PARTICULAR PURPOSE.
- WARRANTY, INCLUDING OF
- Project/Equipment
- Document
- Designer
- Drawn by
- Check.by
- File
- Last Mod.
- Print Date
- Sheet
- Size
- A3
- of
- Rev
- (in symbol R0402_10K_1%_0.0625W_100PPM) 1%

### Library data of the parts
C286 C290 = CC0201_100NF_6.3V_10%_X5R: Non-polarised capacitor; Manufacturer: GENERIC; Part Description: SMD Multilayer Chip Ceramic Capacitor; Manufacturer1 Part Number: 02016D104KAT2A; Tolerance: ±10%; Voltage: 6.3V; TC: X5R; Manufacturer Part Number: CC0201_100NF_6.3V_10%_X5R; Part Number: CC0201_100NF_6.3V_10%_X5R; Value: 100nF; Component Kind: Standard; Component Type: Standard; Pin Count: 2; Status: Not Recommended; Case: 0201; Mounted: Yes; Socket: No; SMD: Yes; Sense: No; Manufacturer1 Example: AVX; Manufacturer1 ComponentHeight: 0.33mm; HelpURL: \\cern.ch\dfs\Applications\Altium\Datasheets\CC0201_X5R_AVX.pdf; Author: CERN DEM JLC; CreateDate: 03.12.2007; LatestRevisionDate: 03.12.2007
C287-C289 = CC0201_100NF_6.3V_10%_X5R: as C398 on sheet SDRAM_DDR3_4x16; Author: CERN DEM JLC; Case: 0201; Component Kind: Standard; Component Type: Standard; CreateDate: 03.12.2007; HelpURL: \\cern.ch\dfs\Applications\Altium\Datasheets\CC0201_X5R_AVX.pdf; LatestRevisionDate: 03.12.2007; Manufacturer Part Number: CC0201_100NF_6.3V_10%_X5R; Manufacturer1 ComponentHeight: 0.33mm; Manufacturer1 Example: AVX; Mounted: Yes; Part Number: CC0201_100NF_6.3V_10%_X5R; Pin Count: 2; SMD: Yes; Socket: No; Status: Not Recommended; Value: 100nF; Sense: No
D10-D14 D18-D22 = PESD3V3S1UB: ESD protection diode; Manufacturer: NXP SEMICONDUCTORS; Part Description: ESD protection diode (23kV); Voltage: 3V3; Power: 330W; PressFit: No; Bonding: No; Manufacturer Part Number: PESD3V3S1UB; PackageDescription: Ultra Small Outline Diode Flat Lead (SOD-523), Body; 1.2mm L X 0.8mm W X 0.65mm H, IPC Medium Density; Part Number: PESD3V3S1UB; Component Kind: Standard; Component Type: Standard; Device: PESD3V3S1UB; Pin Count: 2; Case: SOD523; Mounted: Yes; Socket: No; SMD: Yes; Sense: No; ComponentHeight: 0.65mm; HelpURL: \\cern.ch\dfs\Applications\Altium\Datasheets\PESD3V3S1UB.pdf; Author: CERN DEM JLC; CreateDate: 29.11.2012; LatestRevisionDate: 29.11.2012
D15 D16 D23 = BAT165: Schottky Diode; Part Description: Medium Power AF Schottky Diode; Manufacturer: INFINEON; Voltage: 40V; Power: 750mA; PressFit: No; Bonding: No; Part Number: BAT165; Component Kind: Standard; Component Type: Standard; Device: BAT165; PackageDescription: Small Outline Diode (SOD-323), 1.70mm W X 1.25mm L X 1.10mm H body,  IPC Medium Density; Manufacturer Part Number: BAT165; Pin Count: 2; Case: SOD323; Mounted: Yes; Socket: No; SMD: Yes; Sense: No; ComponentHeight: 1.1mm; HelpURL: \\cern.ch\dfs\Applications\Altium\Datasheets\BAT165.pdf; Author: CERN DEM JLC; CreateDate: 12.11.2014; LatestRevisionDate: 12.11.2014
D17 = PESD3V3S1UB: ESD protection diode; Part Description: ESD protection diode (23kV); Manufacturer: NXP SEMICONDUCTORS; Voltage: 3V3; Power: 330W; PressFit: No; Bonding: No; Part Number: PESD3V3S1UB; Component Kind: Standard; Component Type: Standard; Device: PESD3V3S1UB; PackageDescription: Ultra Small Outline Diode Flat Lead (SOD-523), Body; 1.2mm L X 0.8mm W X 0.65mm H, IPC Medium Density; Manufacturer Part Number: PESD3V3S1UB; Pin Count: 2; Case: SOD523; Mounted: Yes; Socket: No; SMD: Yes; Sense: No; ComponentHeight: 0.65mm; HelpURL: \\cern.ch\dfs\Applications\Altium\Datasheets\PESD3V3S1UB.pdf; Author: CERN DEM JLC; CreateDate: 29.11.2012; LatestRevisionDate: 29.11.2012
IC30 = SN74CB3T3257PW: 4-BIT 1-OF-2 FET Multiplexer/Demultiplexer 2.5V/3.3V Low-Voltage Bus Switch 5V Tolerant Shifter; Manufacturer: TEXAS INSTRUMENTS; PressFit: No; Bonding: No; Part Number: SN74CB3T3257PW; Component Kind: Standard; Component Type: Standard; Device: SN74CB3T3257PW; PackageDescription: SOP, 0.65mm pitch; 16 pin, 4.40mm W X 5.00mm L X 1.20mm H body IPC Medium Density; Part Description: 4-Bit 1-of-2 FET Multiplexer/Demultiplexer 2.5V/3.3V Low-Voltage Bus Switch 5V Tolerant Shifter; Manufacturer Part Number: SN74CB3T3257PW; Pin Count: 16; Case: TSSOP16; Mounted: Yes; Socket: No; SMD: Yes; Sense: No; ComponentHeight: 1.2mm; Author: CERN DEM JLC; HelpURL: \\cern.ch\dfs\Applications\Altium\Datasheets\SN74CB3T3257PW.pdf; CreateDate: 30.01.2012; LatestRevisionDate: 30.01.2012
IC31 IC32 = SN74AVC2T245RSWR: Dual-Bit Dual-Supply Bus Transceiver With Configurable Voltage Translation and 3-State Outputs; Manufacturer: TEXAS INSTRUMENTS; PressFit: No; Bonding: No; Part Number: SN74AVC2T245RSWR; Component Kind: Standard; Component Type: Standard; Device: SN74AVC2T245RSWR; PackageDescription: QFN, 0.40mm Pitch, Rect.;10 Pin, 1.80mm L X 1.40mm W X 0.55mm H Body, IPC Medium Density; Status: Not Recommended; Part Description: Dual-Bit Dual-Supply Bus Transceiver With Configurable Voltage Translation and 3-State Outputs; Manufacturer Part Number: SN74AVC2T245RSWR; Pin Count: 10; Case: QFN10; Mounted: Yes; Socket: No; SMD: Yes; Sense: No; ComponentHeight: 0.55mm; Author: CERN DEM JLC; HelpURL: \\cern.ch\dfs\Applications\Altium\Datasheets\SN74AVC2T245RSWR.pdf; CreateDate: 07.07.2014; LatestRevisionDate: 30.03.2017
J6 = MOLEX_87832-1420: Connector 14 Male; Manufacturer: MOLEX; Part Description: 2.00mm (.079") Pitch Milli-Grid™ Header, Surface Mount, Vertical, Shrouded, 14 Circuits,with Locking Windows and Centre Polarization Slot, PCB Locator; PressFit: No; Manufacturer Part Number: 87832-1420; Part Number: MOLEX_87832-1420; Component Kind: Standard; Component Type: Standard; Pin Count: 14; Family: Milli-Grid™; Mounted: Yes; Socket: No; SMD: Yes; Sense: No; Status: None; ComponentHeight: 7.6mm; HelpURL: \\cern.ch\dfs\Applications\Altium\Datasheets\MOLEX_87832-1420.pdf; Author: CERN DEM JLC; CreateDate: 09.09.2008; LatestRevisionDate: 09.09.2008
R147-R154 R160 R162-R165 R170 R171 = R0402_10K_1%_0.0625W_100PPM: as R284 on sheet SDRAM_DDR3_4x16; Manufacturer Part Number: R0402_10K_1%_0.0625W_100PPM; Part Number: R0402_10K_1%_0.0625W_100PPM; Tolerance: ±1%; Value: 10k; Component Kind: Standard; Component Type: Standard; Pin Count: 2; Status: Not Recommended; Power: 0.0625W; Case: 0402; Mounted: Yes; Sense: No; Socket: No; SMD: Yes; Manufacturer1 Example: YAGEO PHYCOMP; Manufacturer1 ComponentHeight: 0.4mm; HelpURL: \\cern.ch\dfs\Applications\Altium\Datasheets\R0402_Phycomp_RC0402.pdf; Author: CERN DEM JLC; CreateDate: 03.12.2007; LatestRevisionDate: 17.10.2012
R155-R159 R166-R169 R470 = R0402_0R_JUMPER: Resistor; Manufacturer: GENERIC; Part Description: 1A (0.05R Max DC Resistance) Zero Ohm Jumper; Manufacturer1 Part Number: 232270591001L; PressFit: No; Manufacturer Part Number: R0402_0R_JUMPER; Part Number: R0402_0R_JUMPER; Value: 0; Component Kind: Standard; Component Type: Standard; Pin Count: 2; Status: Not Recommended; Case: 0402; Mounted: Yes; Sense: No; Socket: No; SMD: Yes; Manufacturer1 Example: YAGEO PHYCOMP; Manufacturer1 ComponentHeight: 0.4mm; HelpURL: \\cern.ch\dfs\Applications\Altium\Datasheets\R0402_Phycomp_RC0402.pdf; Author: CERN DEM JLC; CreateDate: 03.12.2007; LatestRevisionDate: 17.10.2012
R161 = R0402_10K_1%_0.0625W_100PPM: Resistor - 1%; Part Description: General Purpose Thick Film Chip Resistor; Manufacturer: GENERIC; Manufacturer1 Part Number: 232270671003L; TC: ±100ppm/°C; PressFit: No; Part Number: R0402_10K_1%_0.0625W_100PPM; Component Kind: Standard; Component Type: Standard; Pin Count: 2; Value: 10k; Status: Not Recommended; Power: 0.0625W; Tolerance: ±1%; Manufacturer Part Number: R0402_10K_1%_0.0625W_100PPM; Case: 0402; Mounted: Yes; Sense: No; Socket: No; SMD: Yes; Manufacturer1 Example: YAGEO PHYCOMP; Manufacturer1 ComponentHeight: 0.4mm; HelpURL: \\cern.ch\dfs\Applications\Altium\Datasheets\R0402_Phycomp_RC0402.pdf; Author: CERN DEM JLC; CreateDate: 03.12.2007; LatestRevisionDate: 17.10.2012
T2-T4 = BSS138LT1G: N-CHANNEL MOSFET WITH DIODE; Part Description: 50V 200mA N-Channel Enhancement Mode Field-Effect Transistor; Manufacturer: ON SEMICONDUCTOR; PressFit: No; Bonding: No; Part Number: BSS138LT1G; Component Kind: Standard; Component Type: Standard; Device: BSS138LT1G; PackageDescription: SOT23 3-Leads, Pitch 0.95mm - Body 1.4x3mm, IPC Medium Density; Manufacturer Part Number: BSS138LT1G; Pin Count: 3; Case: SOT23-3; Mounted: Yes; Socket: No; SMD: Yes; Sense: No; ComponentHeight: 1.11mm; HelpURL: \\cern.ch\dfs\Applications\Altium\Datasheets\BSS138LT1G.pdf; Author: CERN DEM JLC; CreateDate: 23.03.2009; LatestRevisionDate: 23.03.2009